# Altium project FA18_AMPCD.PrjPcb
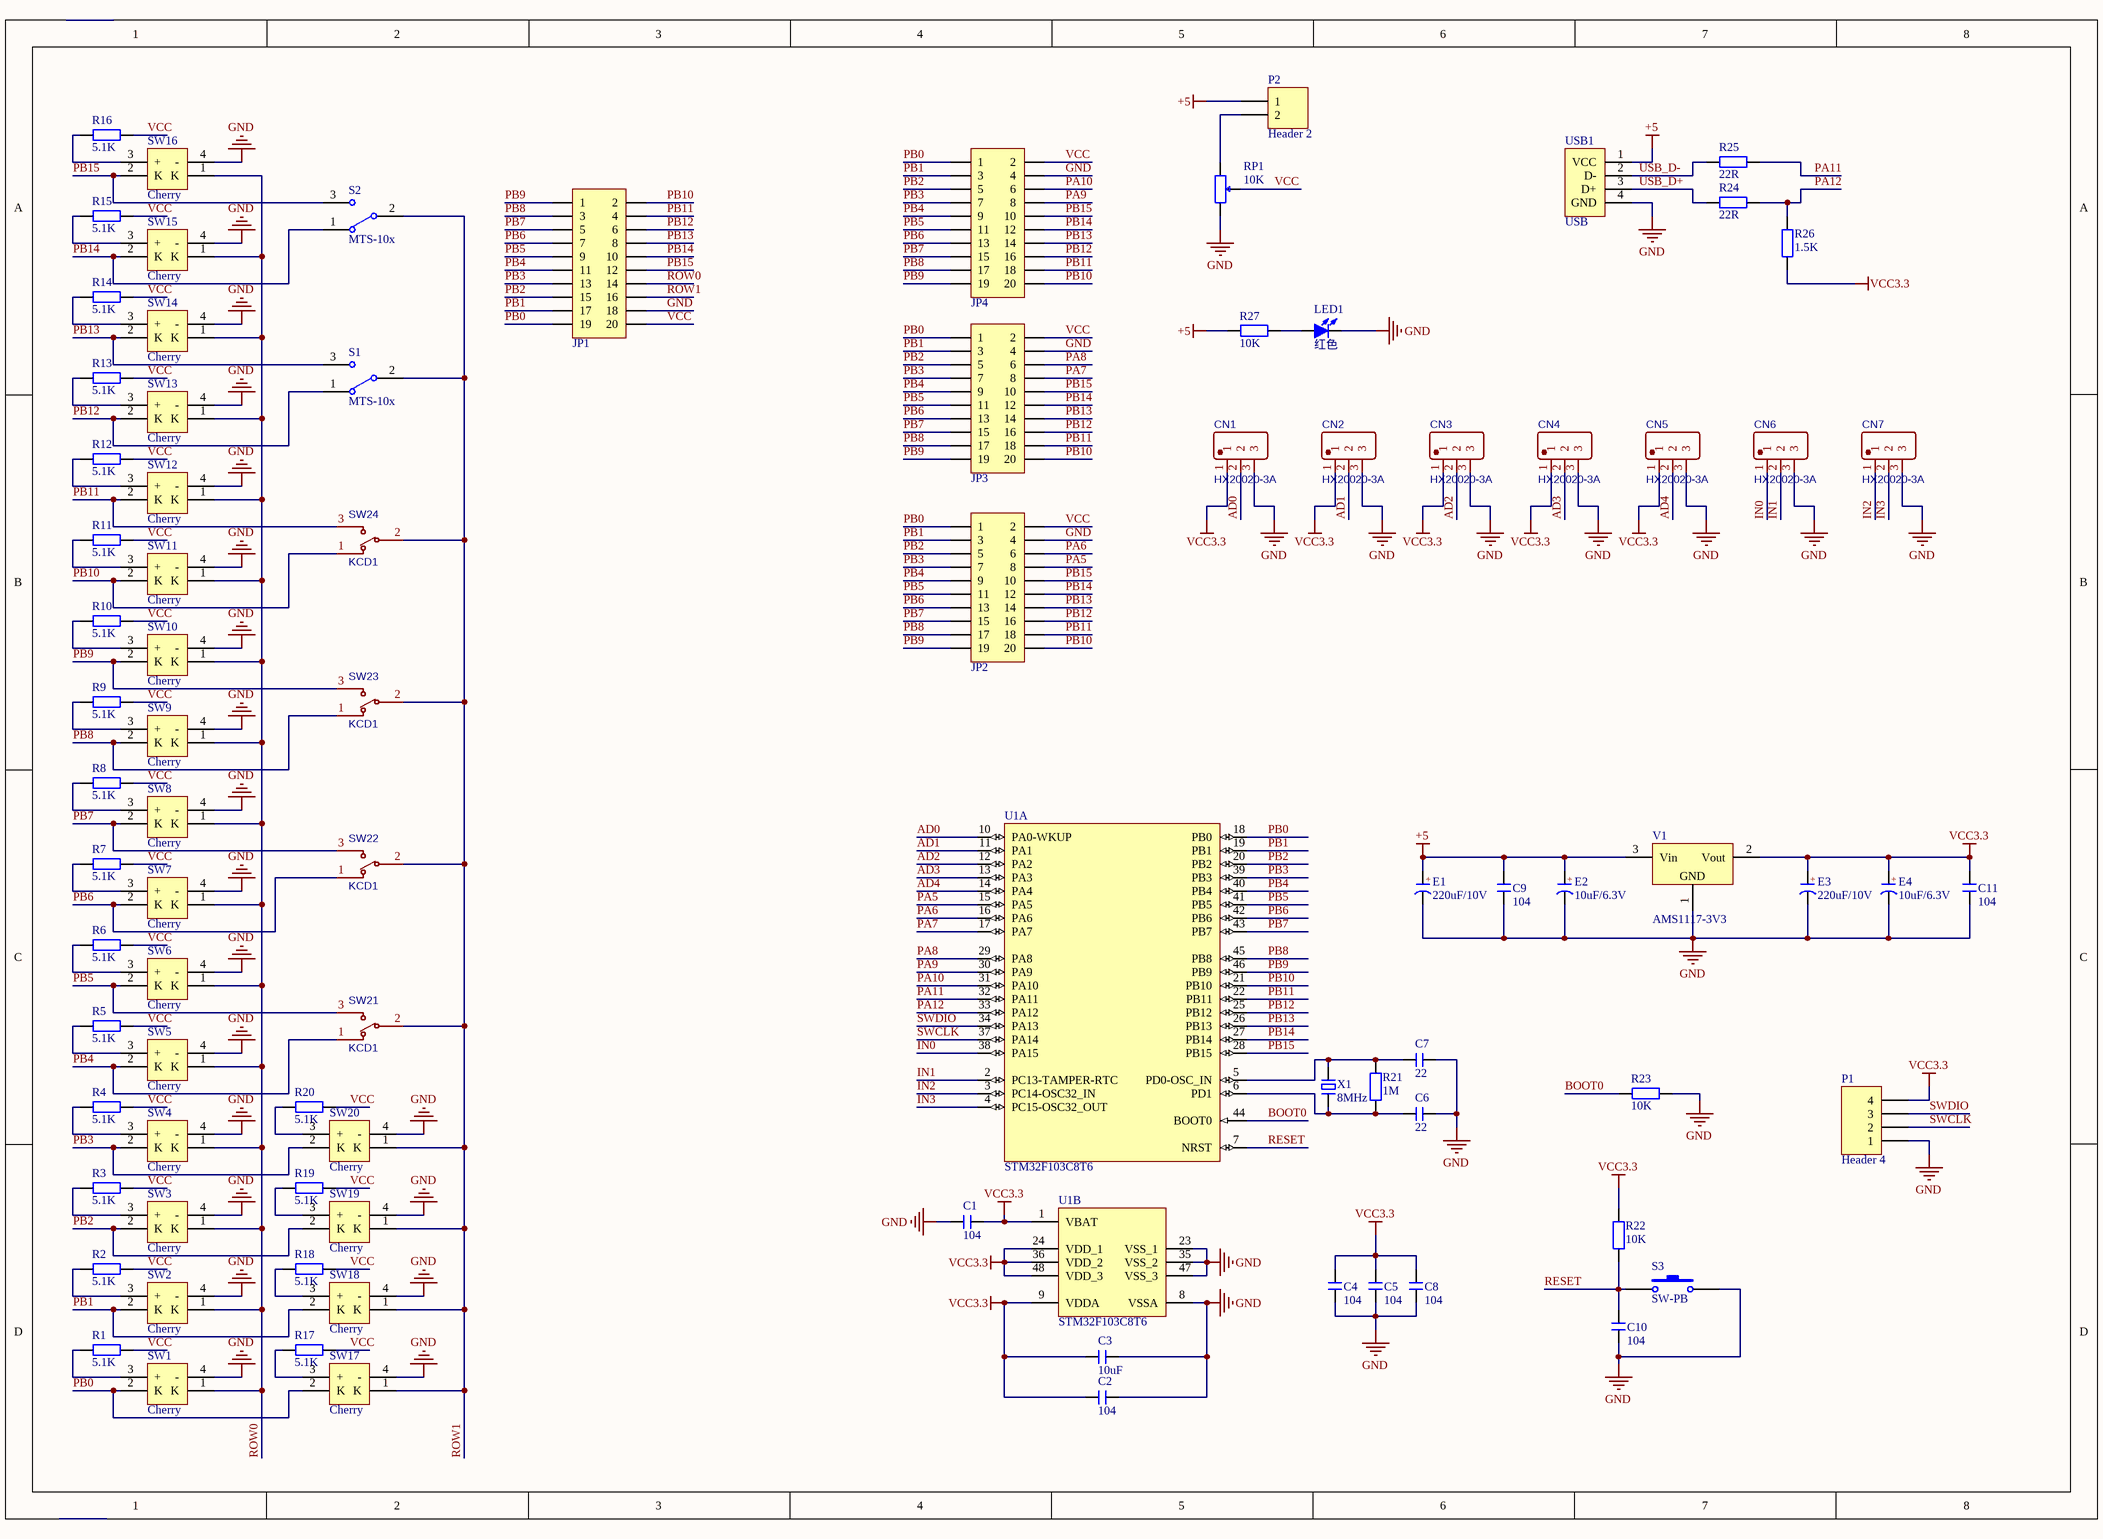
[diagram p0: FA18_AMPCD.SchDoc]
1 sheet, 88 parts. Net scope: global (net labels, ports and power ports of the same name join across sheets).
Board files: FA18_AMPCD.PcbDoc, CPU.PcbDoc

## Sheet FA18_AMPCD.SchDoc
size A3; SheetNumber: 1; SheetTotal: 1

### Parts
C1  104  [C 0603_L]
C2  104  [C 0603_L]
C3  10uF  [C 0603_L]
C4  104  [C 0603_L]
C5  104  [C 0603_L]
C6  22  [C 0603_L]
C7  22  [C 0603_L]
C8  104  [C 0603_L]
C9  104  [C 0603_L]
C10  104  [C 0603_L]
C11  104  [C 0603_L]
CN1  HX20020-3A  [CONN-TH_3P-P2.00_HX20020-3A]
CN2  HX20020-3A  [CONN-TH_3P-P2.00_HX20020-3A]
CN3  HX20020-3A  [CONN-TH_3P-P2.00_HX20020-3A]
CN4  HX20020-3A  [CONN-TH_3P-P2.00_HX20020-3A]
CN5  HX20020-3A  [CONN-TH_3P-P2.00_HX20020-3A]
CN6  HX20020-3A  [CONN-TH_3P-P2.00_HX20020-3A]
CN7  HX20020-3A  [CONN-TH_3P-P2.00_HX20020-3A]
E1  220uF/10V  [CM D(6.3*5.4)]
E2  10uF/6.3V  [CD B(3528)]
E3  220uF/10V  [CM D(6.3*5.4)]
E4  10uF/6.3V  [CD B(3528)]
JP1  Header 2X10  [PHB2.0-LI-2x10P]  (value not drawn)
JP2  Header 2X10  [PHB2.0-LI-2x10P]  (value not drawn)
JP3  Header 2X10  [PHB2.0-LI-2x10P]  (value not drawn)
JP4  Header 2X10  [PHB2.0-LI-2x10P]  (value not drawn)
LED1  红色  [LED 0603W]
P1  Header 4  [HDR1X4]
P2  Header 2  [HDR1X2]
R1  5.1K  [R 0603_L]
R2  5.1K  [R 0603_L]
R3  5.1K  [R 0603_L]
R4  5.1K  [R 0603_L]
R5  5.1K  [R 0603_L]
R6  5.1K  [R 0603_L]
R7  5.1K  [R 0603_L]
R8  5.1K  [R 0603_L]
R9  5.1K  [R 0603_L]
R10  5.1K  [R 0603_L]
R11  5.1K  [R 0603_L]
R12  5.1K  [R 0603_L]
R13  5.1K  [R 0603_L]
R14  5.1K  [R 0603_L]
R15  5.1K  [R 0603_L]
R16  5.1K  [R 0603_L]
R17  5.1K  [R 0603_L]
R18  5.1K  [R 0603_L]
R19  5.1K  [R 0603_L]
R20  5.1K  [R 0603_L]
R21  1M  [R 0603_L]
R22  10K  [R 0603_L]
R23  10K  [R 0603_L]
R24  22R  [R 0603_L]
R25  22R  [R 0603_L]
R26  1.5K  [R 0603_L]
R27  10K  [R 0603_L]
RP1  10K  [WH148-1-G15]
S1  MTS-10x  [MTS-10x]
S2  MTS-10x  [MTS-10x]
S3  SW-PB  [SW_PB2_A1]
SW1  Cherry  [LSW DIP-CHERRY]
SW2  Cherry  [LSW DIP-CHERRY]
SW3  Cherry  [LSW DIP-CHERRY]
SW4  Cherry  [LSW DIP-CHERRY]
SW5  Cherry  [LSW DIP-CHERRY]
SW6  Cherry  [LSW DIP-CHERRY]
SW7  Cherry  [LSW DIP-CHERRY]
SW8  Cherry  [LSW DIP-CHERRY]
SW9  Cherry  [LSW DIP-CHERRY]
SW10  Cherry  [LSW DIP-CHERRY]
SW11  Cherry  [LSW DIP-CHERRY]
SW12  Cherry  [LSW DIP-CHERRY]
SW13  Cherry  [LSW DIP-CHERRY]
SW14  Cherry  [LSW DIP-CHERRY]
SW15  Cherry  [LSW DIP-CHERRY]
SW16  Cherry  [LSW DIP-CHERRY]
SW17  Cherry  [LSW DIP-CHERRY]
SW18  Cherry  [LSW DIP-CHERRY]
SW19  Cherry  [LSW DIP-CHERRY]
SW20  Cherry  [LSW DIP-CHERRY]
SW21  KCD1  [KCD1]
SW22  KCD1  [KCD1]
SW23  KCD1  [KCD1]
SW24  KCD1  [KCD1]
U1  STM32F103C8T6  [LQFP48_N]  (parts A,B of 2)
USB1  USB  [USB-B/S_A]
V1  AMS1117-3V3  [SOT223_L]
X1  8MHz  [OSC HC-49S]

### Nets
+5: C9.2 E1.1(A) E2.1(A) P2.1 R27.1 USB1.1(VCC) V1.3(Vin)
GND: C1.1 C2.2 C3.2 C4.1 C5.1 C6.2 C7.2 C8.1 C9.1 C10.2 C11.1 CN1.3 CN2.3 CN3.3 CN4.3 CN5.3 CN6.3 CN7.3 E1.2(K) E2.2(K) E3.2(K) E4.2(K) JP1.18 JP2.4 JP3.4 JP4.4 LED1.2(K) P1.1 R23.2 RP1.3 S3.2 SW1.4(-) SW2.4(-) SW3.4(-) SW4.4(-) SW5.4(-) SW6.4(-) SW7.4(-) SW8.4(-) SW9.4(-) SW10.4(-) SW11.4(-) SW12.4(-) SW13.4(-) SW14.4(-) SW15.4(-) SW16.4(-) SW17.4(-) SW18.4(-) SW19.4(-) SW20.4(-) U1.8(VSSA) U1.23(VSS_1) U1.35(VSS_2) U1.47(VSS_3) USB1.4(GND) V1.1(GND)
VCC3.3: C1.2 C2.1 C3.1 C4.2 C5.2 C8.2 C11.2 CN1.1 CN2.1 CN3.1 CN4.1 CN5.1 E3.1(A) E4.1(A) P1.4 R22.2 R26.1 U1.1(VBAT) U1.9(VDDA) U1.24(VDD_1) U1.36(VDD_2) U1.48(VDD_3) V1.2(Vout)
AD0: CN1.2 U1.10(PA0-WKUP)
AD1: CN2.2 U1.11(PA1)
AD2: CN3.2 U1.12(PA2)
AD3: CN4.2 U1.13(PA3)
AD4: CN5.2 U1.14(PA4)
BOOT0: R23.1 U1.44(BOOT0)
IN0: CN6.1 U1.38(PA15)
IN1: CN6.2 U1.2(PC13-TAMPER-RTC)
IN2: CN7.1 U1.3(PC14-OSC32_IN)
IN3: CN7.2 U1.4(PC15-OSC32_OUT)
PA5: JP2.8 U1.15(PA5)
PA6: JP2.6 U1.16(PA6)
PA7: JP3.8 U1.17(PA7)
PA8: JP3.6 U1.29(PA8)
PA9: JP4.8 U1.30(PA9)
PA10: JP4.6 U1.31(PA10)
PA11: R25.2 U1.32(PA11)
PA12: R24.2 R26.2 U1.33(PA12)
PB0: JP1.19 JP2.1 JP3.1 JP4.1 SW1.2(K) SW17.2(K) U1.18(PB0)
PB1: JP1.17 JP2.3 JP3.3 JP4.3 SW2.2(K) SW18.2(K) U1.19(PB1)
PB2: JP1.15 JP2.5 JP3.5 JP4.5 SW3.2(K) SW19.2(K) U1.20(PB2)
PB3: JP1.13 JP2.7 JP3.7 JP4.7 SW4.2(K) SW20.2(K) U1.39(PB3)
PB4: JP1.11 JP2.9 JP3.9 JP4.9 SW5.2(K) SW21.1 U1.40(PB4)
PB5: JP1.9 JP2.11 JP3.11 JP4.11 SW6.2(K) SW21.3 U1.41(PB5)
PB6: JP1.7 JP2.13 JP3.13 JP4.13 SW7.2(K) SW22.1 U1.42(PB6)
PB7: JP1.5 JP2.15 JP3.15 JP4.15 SW8.2(K) SW22.3 U1.43(PB7)
PB8: JP1.3 JP2.17 JP3.17 JP4.17 SW9.2(K) SW23.1 U1.45(PB8)
PB9: JP1.1 JP2.19 JP3.19 JP4.19 SW10.2(K) SW23.3 U1.46(PB9)
PB10: JP1.2 JP2.20 JP3.20 JP4.20 SW11.2(K) SW24.1 U1.21(PB10)
PB11: JP1.4 JP2.18 JP3.18 JP4.18 SW12.2(K) SW24.3 U1.22(PB11)
PB12: JP1.6 JP2.16 JP3.16 JP4.16 S1.1 SW13.2(K) U1.25(PB12)
PB13: JP1.8 JP2.14 JP3.14 JP4.14 S1.3 SW14.2(K) U1.26(PB13)
PB14: JP1.10 JP2.12 JP3.12 JP4.12 S2.1 SW15.2(K) U1.27(PB14)
PB15: JP1.12 JP2.10 JP3.10 JP4.10 S2.3 SW16.2(K) U1.28(PB15)
RESET: C10.1 R22.1 S3.1 U1.7(NRST)
ROW0: JP1.14 SW1.1(K) SW2.1(K) SW3.1(K) SW4.1(K) SW5.1(K) SW6.1(K) SW7.1(K) SW8.1(K) SW9.1(K) SW10.1(K) SW11.1(K) SW12.1(K) SW13.1(K) SW14.1(K) SW15.1(K) SW16.1(K)
ROW1: JP1.16 S1.2 S2.2 SW17.1(K) SW18.1(K) SW19.1(K) SW20.1(K) SW21.2 SW22.2 SW23.2 SW24.2
SWCLK: P1.2 U1.37(PA14)
SWDIO: P1.3 U1.34(PA13)
USB_D+: R24.1 USB1.3(D+)
USB_D-: R25.1 USB1.2(D-)
VCC: JP1.20 JP2.2 JP3.2 JP4.2 R1.2 R2.2 R3.2 R4.2 R5.2 R6.2 R7.2 R8.2 R9.2 R10.2 R11.2 R12.2 R13.2 R14.2 R15.2 R16.2 R17.2 R18.2 R19.2 R20.2 RP1.2
NetC6_1: C6.1 R21.1 U1.6(PD1) X1.1
NetC7_1: C7.1 R21.2 U1.5(PD0-OSC_IN) X1.2
NetLED1_1: LED1.1(A) R27.2
NetP2_2: P2.2 RP1.1
NetR1_1: R1.1 SW1.3(+)
NetR2_1: R2.1 SW2.3(+)
NetR3_1: R3.1 SW3.3(+)
NetR4_1: R4.1 SW4.3(+)
NetR5_1: R5.1 SW5.3(+)
NetR6_1: R6.1 SW6.3(+)
NetR7_1: R7.1 SW7.3(+)
NetR8_1: R8.1 SW8.3(+)
NetR9_1: R9.1 SW9.3(+)
NetR10_1: R10.1 SW10.3(+)
NetR11_1: R11.1 SW11.3(+)
NetR12_1: R12.1 SW12.3(+)
NetR13_1: R13.1 SW13.3(+)
NetR14_1: R14.1 SW14.3(+)
NetR15_1: R15.1 SW15.3(+)
NetR16_1: R16.1 SW16.3(+)
NetR17_1: R17.1 SW17.3(+)
NetR18_1: R18.1 SW18.3(+)
NetR19_1: R19.1 SW19.3(+)
NetR20_1: R20.1 SW20.3(+)

### Notes on the sheet
- (in symbol CE_SMD) +
- (in symbol CT) +

### Library data of the parts
C1-C11 = C: 贴片电容; BOM名称: 无极性贴片电容; 淘宝ID: 封装库来自淘宝 ID：黄晶宝石; 联系售后，技术支持: https://shop463601444.taobao.com; 唯一出售店铺网址: https://shop463601444.taobao.com
CN1-CN7 = HX20020-3A: BOM_Manufacturer: HX(Zhejiang Yueqing Hongxing Elec); Contributor: LCSC; BOM_Supplier: LCSC; BOM_Supplier Part: C442245; BOM_Manufacturer Part: HX20020-3A; BOM_JLCPCB Part Class: Extended Part; spicePre: C; spiceSymbolName: HX20020-3A
E1 E3 = CE_SMD: 贴片电解电容; 版权归属: 封装库来自淘宝 ID：黄晶宝石; BOM名称: 贴片电解电容; 联系售后: https://shop463601444.taobao.com
E2 E4 = CT: 贴片钽电容; 淘宝ID: 封装库来自淘宝 ID：黄晶宝石; BOM名称: 贴片钽电容; 联系售后: https://shop463601444.taobao.com
JP1-JP4 = Header 10X2: 10*2P接插件; 封装库来自淘宝卖家 ID：黄晶宝石: 其他店铺购入均为盗版，不享受售后技术支持服务，请立即申请退款
LED1 = LED-SMD: 贴片LED; 版权归属: 封装库来自淘宝 ID：黄晶宝石; BOM名称: 贴片LED; 学习资源: https://shop463601444.taobao.com
P1 = Header 4: Header, 4-Pin; LatestRevisionDate: 17-Jul-2002; LatestRevisionNote: Re-released for DXP Platform.; Publisher: Altium Limited
P2 = Header 2: Header, 2-Pin; LatestRevisionDate: 17-Jul-2002; LatestRevisionNote: Re-released for DXP Platform.; Publisher: Altium Limited
R1-R27 = R: 贴片电阻; 版权归属: 来自淘宝 ID：黄晶宝石; 封装库来自淘宝卖家 ID：黄晶宝石: 其他店铺购入均为盗版，不享受售后技术支持服务，请立即申请退款; BOM名称: 贴片电阻; 联系售后: https://shop463601444.taobao.com
RP1 = RP: 单联电位器; BOM名称: 插件电位器; 版权归属: 封装库来自淘宝 ID：黄晶宝石; 联系售后: https://shop463601444.taobao.com
S1 S2 = MTS-10x: MTS10x系列3脚扭子开关; 版权归属: 封装库来自淘宝 ID：黄晶宝石; BOM名称: MTS10x系列3脚扭子开关; 学习资源: https://shop463601444.taobao.com
S3 = SW-PB: 微动开关; Published: 24-Mar-1999; LatestRevisionDate: 17-Jul-2002; LatestRevisionNote: Re-released for DXP Platform.; PackageReference: SPST-2; Publisher: Altium Limited
SW1-SW20 = LSW: 带灯机械按键开关; 版权归属: 封装库来自淘宝 ID：黄晶宝石; BOM名称: 带灯机械按键开关; 学习资源: https://shop463601444.taobao.com
SW21-SW24 = KCD1: 船型开关; BOM_Manufacturer: HONGJU(宏聚); BOM_Manufacturer Part: MR1-138-C6N-BBAA; Contributor: LCSC; BOM_Supplier: LCSC; BOM_Supplier Part: C268223; BOM_JLCPCB Part Class: Extended Part; spicePre: S; spiceSymbolName: MR1-138-C6N-BBAA
U1 = STM32F103C8T6: STM32 ARM-based 32-bit MCU Performance Line with 64 kB Flash, 20 kB Internal RAM, -40 to +85癈 Temperature, 48-Pin LQFP, Tray; DatasheetVersion: rev13.0, Apr-2011; PackageVersion: rev13, Apr-2011; PackageReference: LQFP48; PackageDescription: 48-Pin Low-Profile Quad Flat Pack, 7 x 7 mm Body, 0.5 mm Pitch (LQFP48); ComponentLink1Description: Manufacturer URL; ComponentLink1URL: http://www.st.com/; ComponentLink2Description: STM32F103 Datasheet; ComponentLink2URL: http://www.st.com/internet/com/TECHNICAL_RESOURCES/TECHNICAL_LITERATURE/DATASHEET/CD00161566.pdf; ComponentLink3Description: STM32 Family Web Page; ComponentLink3URL: www.st.com/stm32; 联系售后: https://shop463601444.taobao.com
USB1 = USB-B/S: USB-B型母接口; 版权归属: 封装库来自淘宝 ID：黄晶宝石; BOM名称: USB-B型母接口; 学习资源: https://shop463601444.taobao.com
V1 = AMS1117: 三端稳压芯片; BOM名称: 稳压芯片; 淘宝ID: 封装库来自淘宝 ID：黄晶宝石; 欢迎光临淘宝店铺: https://shop463601444.taobao.com
X1 = XTAL-2P: 2脚无源脚晶振; 版权归属: 封装库来自淘宝卖家 ID：黄晶宝石; BOM名称: 2脚无源脚晶振; 学习资源: https://shop463601444.taobao.com